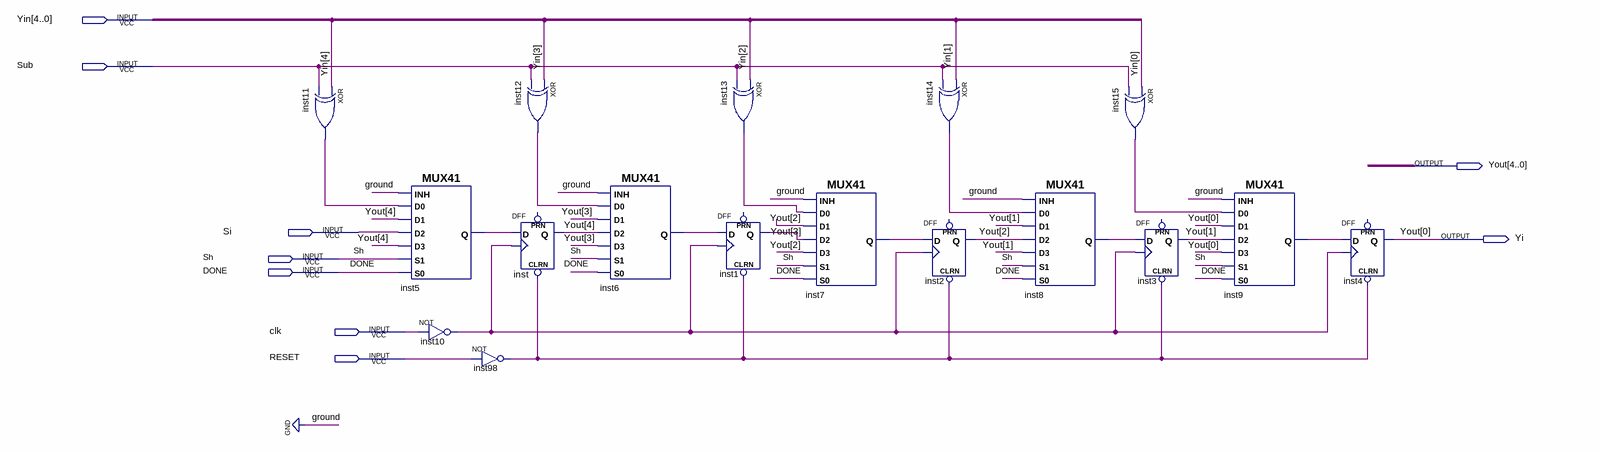
[diagram p0: schematic sheet]
// Quartus schematic yshift.bdf as structural Verilog: 17 symbols, 9 pins
module yshift (
  input  [4:0] Yin,
  input  Sub,
  input  Si,
  input  Sh,
  input  DONE,
  input  clk,
  input  RESET,
  output [4:0] Yout,
  output Yi
);

  wire inst5_q, inst6_q, inst7_q, inst8_q, inst9_q, inst10_out, inst11_out, inst12_out, inst13_out,
       inst14_out, inst15_out, inst98_out;

  xor inst11 (inst11_out, Yin[4], Sub);
  MUX41 inst5 (.S0(DONE), .D2(Si), .S1(Sh), .D3(Yout[4]), .D0(inst11_out), .INH(1'b0), .D1(Yout[4]), .Q(inst5_q));
  not inst10 (inst10_out, clk);
  not inst98 (inst98_out, RESET);
  xor inst12 (inst12_out, Yin[3], Sub);
  DFF inst (.CLRN(inst98_out), .CLK(inst10_out), .D(inst5_q), .Q(Yout[4]));  // open: PRN
  MUX41 inst6 (.S0(DONE), .D2(Yout[4]), .S1(Sh), .D3(Yout[3]), .D0(inst12_out), .INH(1'b0), .D1(Yout[3]), .Q(inst6_q));
  xor inst13 (inst13_out, Yin[2], Sub);
  DFF inst1 (.CLRN(inst98_out), .CLK(inst10_out), .D(inst6_q), .Q(Yout[3]));  // open: PRN
  MUX41 inst7 (.S0(DONE), .D2(Yout[3]), .S1(Sh), .D3(Yout[2]), .D0(inst13_out), .INH(1'b0), .D1(Yout[2]), .Q(inst7_q));
  xor inst14 (inst14_out, Yin[1], Sub);
  DFF inst2 (.CLRN(inst98_out), .CLK(inst10_out), .D(inst7_q), .Q(Yout[2]));  // open: PRN
  MUX41 inst8 (.S0(DONE), .D2(Yout[2]), .S1(Sh), .D3(Yout[1]), .D0(inst14_out), .INH(1'b0), .D1(Yout[1]), .Q(inst8_q));
  xor inst15 (inst15_out, Yin[0], Sub);
  DFF inst3 (.CLRN(inst98_out), .CLK(inst10_out), .D(inst8_q), .Q(Yout[1]));  // open: PRN
  MUX41 inst9 (.S0(DONE), .D2(Yout[1]), .S1(Sh), .D3(Yi), .D0(inst15_out), .INH(1'b0), .D1(Yi), .Q(inst9_q));
  DFF inst4 (.CLRN(inst98_out), .CLK(inst10_out), .D(inst9_q), .Q(Yi));  // open: PRN

  assign Yout[0] = Yi;
endmodule
